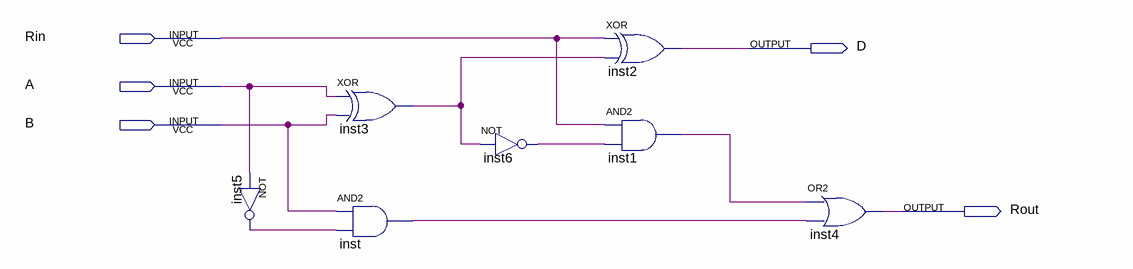
[diagram p0: schematic sheet]
// Quartus schematic SUB.bdf as structural Verilog: 7 symbols, 5 pins
module SUB (
  input  Rin,
  input  A,
  input  B,
  output D,
  output Rout
);

  wire inst1_out, inst3_out, inst5_out, inst6_out, inst_out;

  not inst5 (inst5_out, A);
  xor inst3 (inst3_out, A, B);
  and inst (inst_out, B, inst5_out);
  not inst6 (inst6_out, inst3_out);
  xor inst2 (D, Rin, inst3_out);
  and inst1 (inst1_out, Rin, inst6_out);
  or inst4 (Rout, inst1_out, inst_out);
endmodule
